# Altium project LDO_2024.PrjPcb
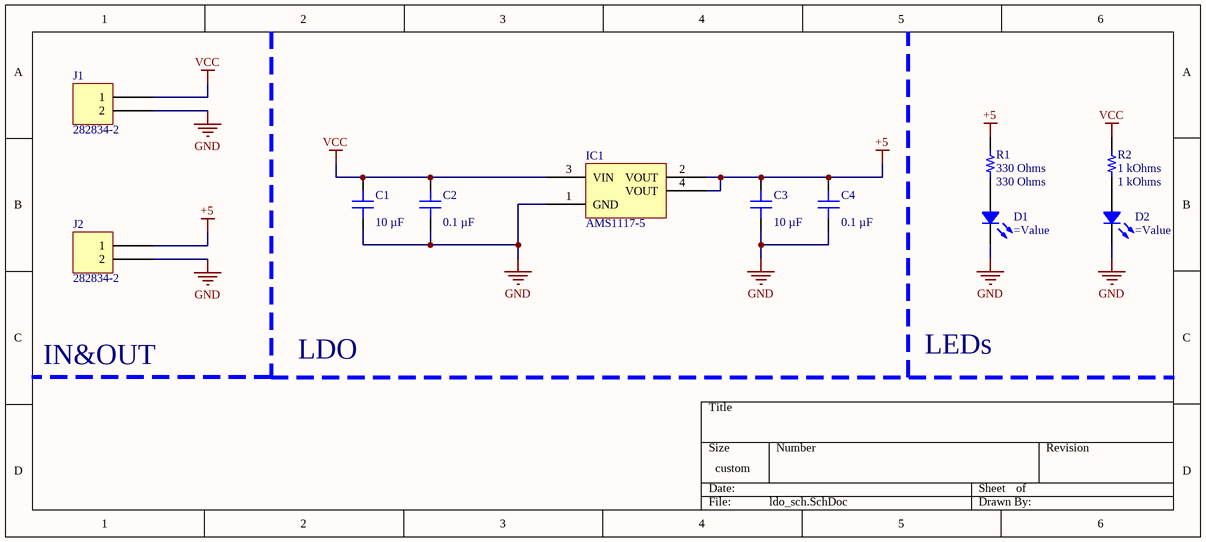
[diagram p0: ldo_sch.SchDoc]
1 sheet, 11 parts. Net scope: global (net labels, ports and power ports of the same name join across sheets).
Board file: ldo_pcb.PcbDoc

## Sheet ldo_sch.SchDoc
size 224 x 100 mm; SheetNumber: 1; SheetTotal: 1

### Parts
C1  10 µF  [CAP 0603_1608]
C2  0.1 µF  [CAP 0603_1608]
C3  10 µF  [CAP 0603_1608]
C4  0.1 µF  [CAP 0603_1608]
D1  (no value)  [LED 0603_1608 RED]
D2  (no value)  [LED 0603_1608 RED]
IC1  AMS1117-5  [ST SOT-223]
J1  282834-2  [TE 282834-2]
J2  282834-2  [TE 282834-2]
R1  330 Ohms  [RES 0603_1608]
R2  1 kOhms  [RES 0603_1608]

### Nets
+5: C3.2 C4.2 IC1.2(VOUT) IC1.4(VOUT) J2.1 R1.2
GND: C1.1 C2.1 C3.1 C4.1 D1.2 D2.2 IC1.1(GND) J1.2 J2.2
VCC: C1.2 C2.2 IC1.3(VIN) J1.1 R2.2
NetD1_1: D1.1 R1.1
NetD2_1: D2.1 R2.1

### Notes on the sheet
- LDO
- LEDs
- IN&OUT

### Library data of the parts
C1 C3 = GRM188Z71A106MA73D: CAP CER 10UF 10V X7R 0603; Part Number: GRM188Z71A106MA73D; Value: 10 µF
C2 C4 = 06031C104K4T2A: CAP CER 0.1UF 100V X7R 0603; Part Number: 06031C104K4T2A; Value: 0.1 µF
D1 D2 = APT1608SEC/J3-AMT: LED RED 0603; Part Number: APT1608SEC/J3-AMT
IC1 = LD1117S50TR: IC REG LINEAR 5V 800MA SOT223; Part Number: LD1117S50TR
J1 J2 = 282834-2: TERM BLK 2P SIDE ENT 2.54MM PCB; Part Number: 282834-2
R1 = AC0603FR-10330RL: RES 330 OHM 1% 1/10W 0603; Part Number: AC0603FR-10330RL; Value: 330 Ohms
R2 = 3-2176366-6: RES 1K OHM 0.1% 0.15W 0603; Part Number: 3-2176366-6; Value: 1 kOhms